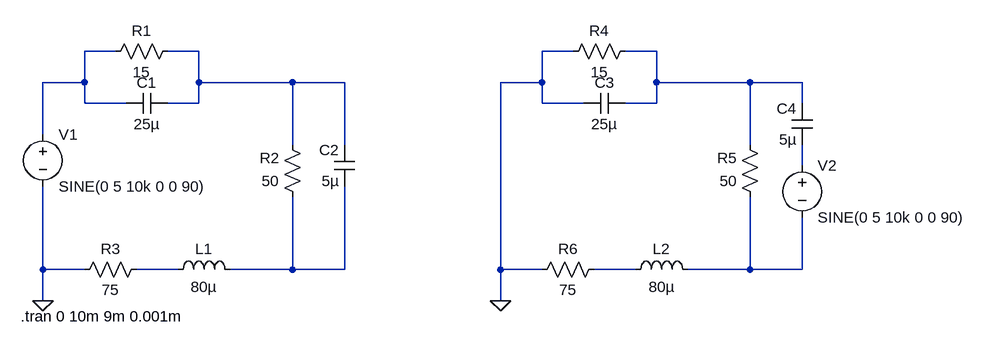
[diagram p0: schematic RTR806_Class_14_20231102_Investigation_of_reciprocity.asc]
RTR806_Class_14_20231102_Investigation_of_reciprocity.asc, the LTspice schematic file:
Version 4
SHEET 1 2148 680
WIRE 112 -32 64 -32
WIRE 240 -32 192 -32
WIRE 816 -32 768 -32
WIRE 944 -32 896 -32
WIRE 64 16 64 -32
WIRE 64 16 0 16
WIRE 240 16 240 -32
WIRE 384 16 240 16
WIRE 464 16 384 16
WIRE 768 16 768 -32
WIRE 768 16 704 16
WIRE 944 16 944 -32
WIRE 1088 16 944 16
WIRE 1168 16 1088 16
WIRE 64 48 64 16
WIRE 128 48 64 48
WIRE 240 48 240 16
WIRE 240 48 192 48
WIRE 768 48 768 16
WIRE 832 48 768 48
WIRE 944 48 944 16
WIRE 944 48 896 48
WIRE 1168 48 1168 16
WIRE 0 96 0 16
WIRE 384 112 384 16
WIRE 464 112 464 16
WIRE 1088 112 1088 16
WIRE 1168 144 1168 112
WIRE 0 304 0 176
WIRE 64 304 0 304
WIRE 208 304 144 304
WIRE 384 304 384 192
WIRE 384 304 288 304
WIRE 464 304 464 176
WIRE 464 304 384 304
WIRE 704 304 704 16
WIRE 768 304 704 304
WIRE 912 304 848 304
WIRE 1088 304 1088 192
WIRE 1088 304 992 304
WIRE 1168 304 1168 224
WIRE 1168 304 1088 304
WIRE 0 352 0 304
WIRE 704 352 704 304
FLAG 0 352 0
FLAG 704 352 0
SYMBOL voltage 0 80 R0
WINDOW 123 0 0 Left 0
WINDOW 39 0 0 Left 0
SYMATTR InstName V1
SYMATTR Value SINE(0 5 10k 0 0 90)
SYMBOL res 208 -48 R90
WINDOW 0 0 56 VBottom 2
WINDOW 3 32 56 VTop 2
SYMATTR InstName R1
SYMATTR Value 15
SYMBOL res 400 208 R180
WINDOW 0 36 76 Left 2
WINDOW 3 36 40 Left 2
SYMATTR InstName R2
SYMATTR Value 50
SYMBOL res 48 320 R270
WINDOW 0 32 56 VTop 2
WINDOW 3 0 56 VBottom 2
SYMATTR InstName R3
SYMATTR Value 75
SYMBOL ind 192 320 R270
WINDOW 0 32 56 VTop 2
WINDOW 3 5 56 VBottom 2
SYMATTR InstName L1
SYMATTR Value 80µ
SYMBOL cap 192 32 R90
WINDOW 0 0 32 VBottom 2
WINDOW 3 32 32 VTop 2
SYMATTR InstName C1
SYMATTR Value 25µ
SYMBOL cap 480 176 R180
WINDOW 0 24 56 Left 2
WINDOW 3 24 8 Left 2
SYMATTR InstName C2
SYMATTR Value 5µ
SYMBOL voltage 1168 128 R0
WINDOW 123 0 0 Left 0
WINDOW 39 0 0 Left 0
SYMATTR InstName V2
SYMATTR Value SINE(0 5 10k 0 0 90)
SYMBOL res 912 -48 R90
WINDOW 0 0 56 VBottom 2
WINDOW 3 32 56 VTop 2
SYMATTR InstName R4
SYMATTR Value 15
SYMBOL res 1104 208 R180
WINDOW 0 36 76 Left 2
WINDOW 3 36 40 Left 2
SYMATTR InstName R5
SYMATTR Value 50
SYMBOL res 752 320 R270
WINDOW 0 32 56 VTop 2
WINDOW 3 0 56 VBottom 2
SYMATTR InstName R6
SYMATTR Value 75
SYMBOL ind 896 320 R270
WINDOW 0 32 56 VTop 2
WINDOW 3 5 56 VBottom 2
SYMATTR InstName L2
SYMATTR Value 80µ
SYMBOL cap 896 32 R90
WINDOW 0 0 32 VBottom 2
WINDOW 3 32 32 VTop 2
SYMATTR InstName C3
SYMATTR Value 25µ
SYMBOL cap 1184 112 R180
WINDOW 0 24 56 Left 2
WINDOW 3 24 8 Left 2
SYMATTR InstName C4
SYMATTR Value 5µ
TEXT -34 376 Left 2 !.tran 0 10m 9m 0.001m

The netlist it stands for:
* RTR806_Class_14_20231102_Investigation_of_reciprocity.asc
V1 N001 0 SINE(0 5 10k 0 0 90)
R1 N002 N001 15
R2 N006 N002 50
R3 0 N005 75
L1 N005 N006 80µ
C1 N002 N001 25µ
C2 N006 N002 5µ
V2 N004 N008 SINE(0 5 10k 0 0 90)
R4 N003 0 15
R5 N008 N003 50
R6 0 N007 75
L2 N007 N008 80µ
C3 N003 0 25µ
C4 N004 N003 5µ
.tran 0 10m 9m 0.001m
.backanno
.end